# EAGLE design BusPirate-demo (EAGLE 5.10)
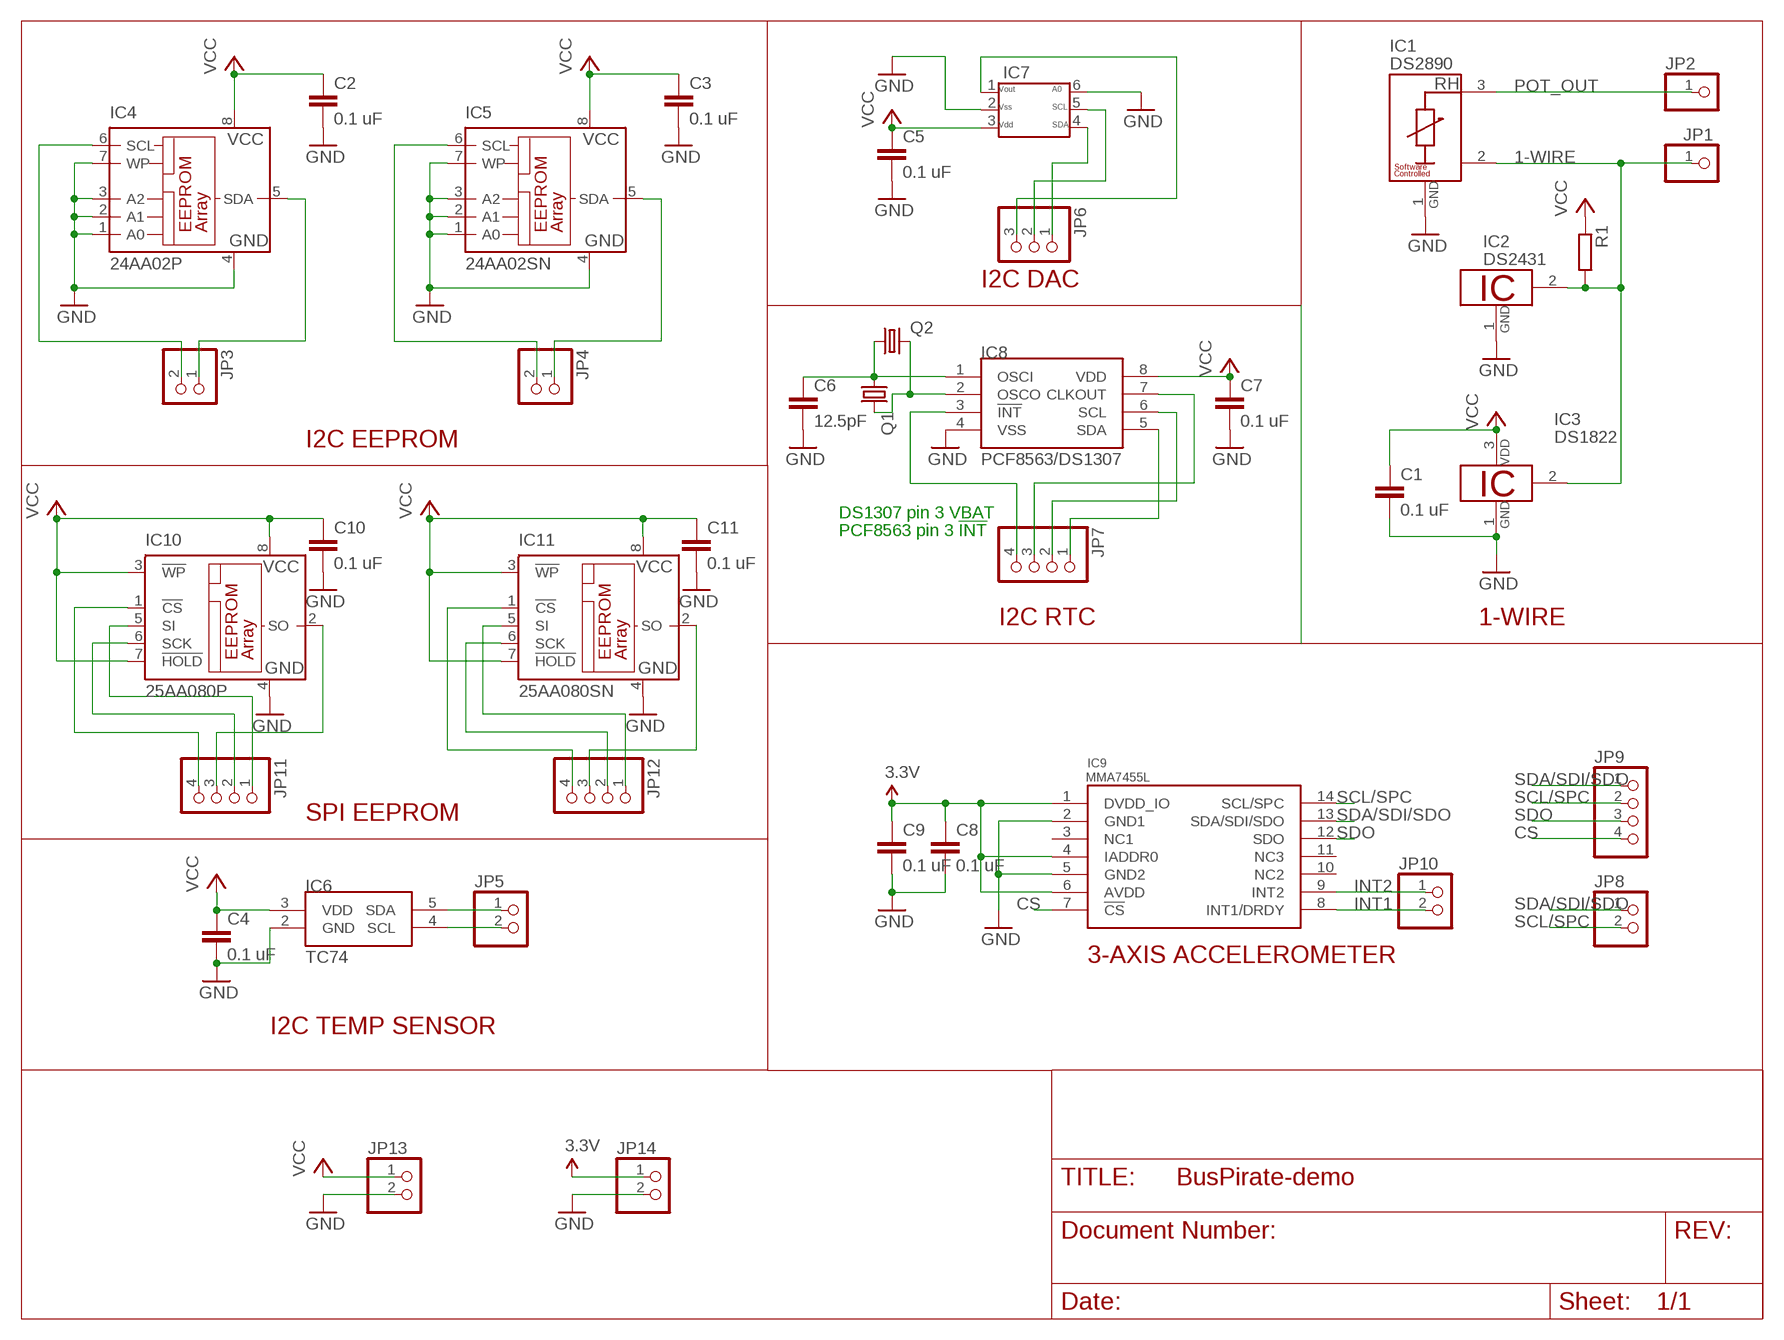
[diagram p0: schematic, sheet 1]

## Parts
C1  0.1 uF  CAPC805  [C805]
C2  0.1 uF  CAPC805  [C805]
C3  0.1 uF  CAPC805  [C805]
C4  0.1 uF  CAPC805  [C805]
C5  0.1 uF  CAPC805  [C805]
C6  12.5pF  CAPC805  [C805]
C7  0.1 uF  CAPC805  [C805]
C8  0.1 uF  CAPC805  [C805]
C9  0.1 uF  CAPC805  [C805]
C10  0.1 uF  CAPC805  [C805]
C11  0.1 uF  CAPC805  [C805]
IC1  DS2890  [TO92-]
IC2  DS2431  [TO92-]
IC3  DS1822  [TO92-]
IC4  24AA02P  [DIL8]
IC5  24AA02SN  [SO-08]
IC6  TC74  [SOT-23-5]
IC7  MCP4725  [SOT23-6]
IC8  PCF8563/DS1307  PCF8563  [SO8]
IC9  MMA7455L  [LGA-14]
IC10  25AA080P  [DIL8]
IC11  25AA080SN  [SO-08]
JP1  PINHD-1X1  [1X01]
JP2  PINHD-1X1  [1X01]
JP3  PINHD-1X2  [1X02]
JP4  PINHD-1X2  [1X02]
JP5  PINHD-1X2  [1X02]
JP6  PINHD-1X3  [1X03]
JP7  PINHD-1X4  [1X04]
JP8  PINHD-1X2  [1X02]
JP9  PINHD-1X4  [1X04]
JP10  PINHD-1X2  [1X02]
JP11  PINHD-1X4  [1X04]
JP12  PINHD-1X4  [1X04]
JP13  PINHD-1X2  [1X02]
JP14  PINHD-1X2  [1X02]
Q1  CRYSTALMM20SS  [MM20SS]
Q2  CRYSTALTC26H  [TC26H]
R1  RESISTORR805R805  [R805]

## Nets
1: IC4.6(SCL) JP3.2
1-WIRE: IC1.2 IC2.2(1W) IC3.2 JP1.1 R1.2
2: IC4.5(SDA) JP3.1
3: IC5.6(SCL) JP4.2
3.3V: C8.1 C9.1 IC9.1(DVDD_IO) IC9.4(IADDR0) IC9.6(AVDD) JP14.1
4: IC5.5(SDA) JP4.1
5: IC6.5(SDA) JP5.1
6: IC6.4(SCL) JP5.2
8: IC7.5 JP6.2
10: IC7.1 JP6.3
11: IC8.3(!INT) JP7.4
12: IC8.7(CLKOUT) JP7.3
13: IC8.6(SCL) JP7.2
14: IC8.5(SDA) JP7.1
CS: IC9.7(!CS) JP9.4
GND: C1.2 C2.2 C3.2 C4.2 C5.2 C6.2 C7.2 C8.2 C9.2 C10.2 C11.2 IC1.1 IC2.1(GND) IC3.1 IC4.1(A0) IC4.2(A1) IC4.3(A2) IC4.4(GND) IC4.7(WP) IC5.1(A0) IC5.2(A1) IC5.3(A2) IC5.4(GND) IC5.7(WP) IC6.2(GND) IC7.2 IC7.6 IC8.4(VSS) IC9.2(GND1) IC9.5(GND2) IC10.4(GND) IC11.4(GND) JP13.2 JP14.2
INT1: IC9.8(INT1/DRDY) JP10.2
INT2: IC9.9(INT2) JP10.1
N$1: IC7.4 JP6.1
N$6: C6.1 IC8.1(OSCI) Q1.1 Q2.1
N$14: IC8.2(OSCO) Q1.4 Q2.2
N$20: IC10.1(!CS) JP11.4
N$21: IC10.2(SO) JP11.3
N$22: IC11.2(SO) JP12.3
N$24: IC10.5(SI) JP11.1
N$30: IC10.6(SCK) JP11.2
N$31: IC11.5(SI) JP12.1
N$32: IC11.6(SCK) JP12.2
N$52: IC11.1(!CS) JP12.4
POT_OUT: IC1.3 JP2.1
SCL/SPC: IC9.14(SCL/SPC) JP8.2 JP9.2
SDA/SDI/SDO: IC9.13(SDA/SDI/SDO) JP8.1 JP9.1
SDO: IC9.12(SDO) JP9.3
VCC: C1.1 C2.1 C3.1 C4.1 C5.1 C7.1 C10.1 C11.1 IC3.3 IC4.8(VCC) IC5.8(VCC) IC6.3(VDD) IC7.3 IC8.8(VDD) IC10.3(!WP) IC10.7(!HOLD) IC10.8(VCC) IC11.3(!WP) IC11.7(!HOLD) IC11.8(VCC) JP13.1 R1.1
Unconnected: IC9.3(NC1) IC9.10(NC2) IC9.11(NC3)

## Notes on the sheet
- I2C DAC
- I2C EEPROM
- DS1307 pin 3 VBAT
- PCF8563 pin 3 !INT
- I2C RTC | 1-WIRE
- SPI EEPROM
- 3-AXIS ACCELEROMETER
- I2C TEMP SENSOR

## Library data of the parts
C1-C11 = dp_devices:CAP
IC1 = 1wire:DS2890: 1-Wire Digital Potentiometer This chip provides a 0..100k RH to GND resistor which can be controlled by software in 256 steps. The RH pin may be connected to levels from 0..11V. Notes: The DS2890P is the same chip in a TSOC6 package with 3 additional pins Vdd, WI and RL, which allows to use the chip as a full featured potentiometer. Author: Jan Kandziora <jjj@gmx.de>
IC2 = 1wire:DS2431: 1024-Bit EEPROM This chip provides a 4x256 Bit EEPROM, which can be programmed@5V. Write protection and OTP emulation are available, too. Author: Jan Kandziora <jjj@gmx.de>
IC3 = 1wire:DS1822: Econo Digital Thermometer This chip provides a onewire thermosensor with approx. 2°C accuracy. A programmable over/undertemperure alarm is available. Notes: Vdd must be applied for accurate measurements at low temperatures, as the parasite power circuit otherwise heats the sensor. If parasite power is used, Vdd has to be connected to GND. The DS18B20 and DS18S20 are similar chips with approx. 0.5°C accuracy. Author: Jan Kandziora <jjj@gmx.de>
IC4 IC5 = microchip:24*: Serial EEPROM I2C
IC6 = dp_devices:TC74
IC7 = dp_devices:MCP4725
IC8 = dp_devices:PCF8563
IC9 = dp_devices:MMA7455L
IC10 IC11 = microchip:25*: Serial EEPROM 4K/ 8K , SPI bus
JP1 JP2 = pinhead - Copy:PINHD-1X1: PIN HEADER
JP3-JP5 JP8 JP10 JP13 JP14 = pinhead - Copy:PINHD-1X2: PIN HEADER
JP6 = pinhead - Copy:PINHD-1X3: PIN HEADER
JP7 JP9 JP11 JP12 = pinhead - Copy:PINHD-1X4: PIN HEADER
Q1 Q2 = crystal:CRYSTAL: CRYSTAL
R1 = dp_devices:RESISTOR

## Board
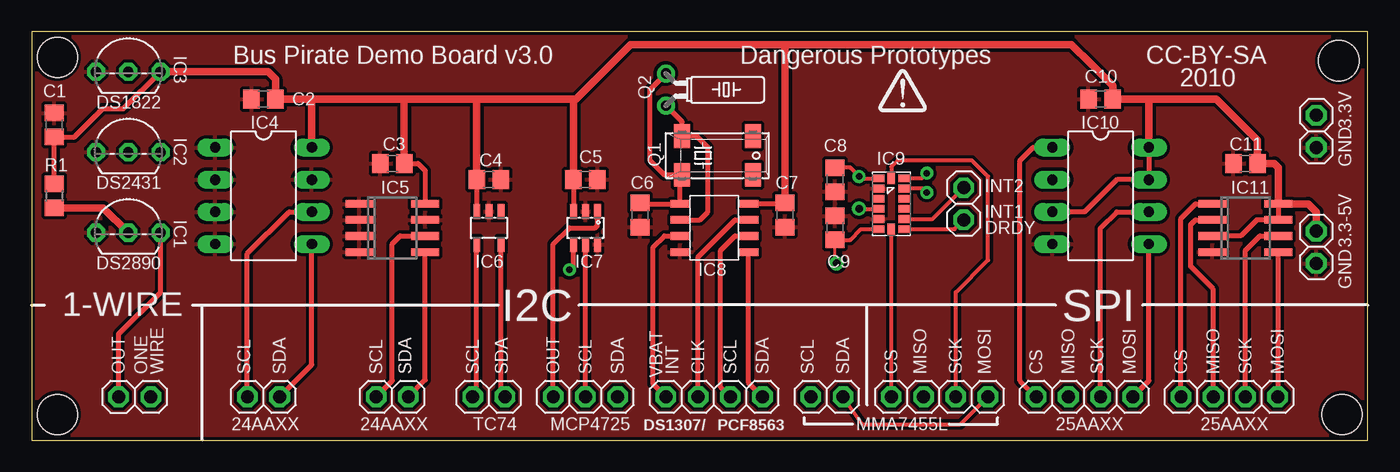
[diagram p1: board, top side]
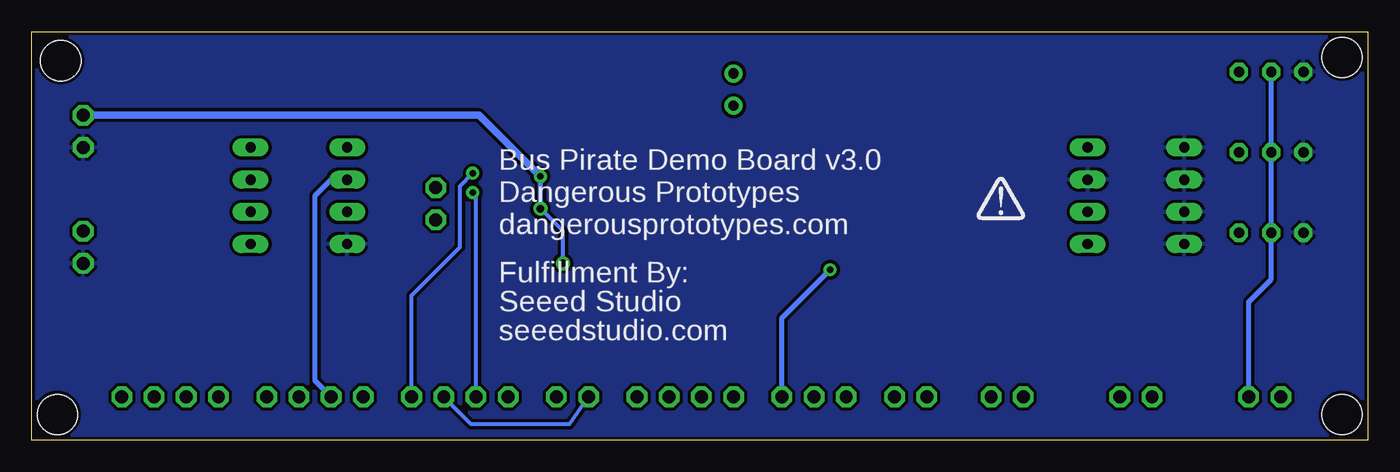
[diagram p2: board, bottom side, seen from below]

Size 105.41 x 32.26 mm. Coordinates in mm from the lower left corner, seen from the top.
Outline: 0,0 105.41,0 105.41,32.26 0,32.26 0,0
Copper layers (1*16): Top 0.035mm / dielectric 1.5mm / Bottom 0.035mm
Design rules "SparkFun - modified *": minimum track width 8mil, minimum drill 15mil, track to track 6mil, track to pad 6mil, pad to pad 6mil, via to via 6mil, smd to smd 6mil, copper to edge 10mil, drill to drill 8mil, minimum pad ring 12mil, minimum via ring 10mil, stop-mask expansion 4mil, vias tented up to drill 25mil, thermal gap 10mil
Holes 3.2 mm at 2.03,2.03 103.38,2.03 103.12,29.97 2.03,30.23

### Footprints (pad centres in the part's own frame; a part is rotated, then mirrored left to right if it is on the bottom)
C805 = smd 1.3 x 1.5: 1 -0.95,0; 2 0.95,0
TO92- = drill 0.813 octagon: 1 -2.54,0; 2 0,0; 3 2.54,0
DIL8 = drill 0.813 long: 1 -3.81,-3.81; 2 -1.27,-3.81; 3 1.27,-3.81; 4 3.81,-3.81; 5 3.81,3.81; 6 1.27,3.81; 7 -1.27,3.81; 8 -3.81,3.81
SO-08 = smd 0.6 x 2.2: 1 -1.905,-2.6; 2 -0.635,-2.6; 3 0.635,-2.6; 4 1.905,-2.6; 5 1.905,2.6; 6 0.635,2.6; 7 -0.635,2.6; 8 -1.905,2.6
SOT-23-5 = smd 0.55 x 1.2: 1 -0.95,-1.3; 2 0,-1.3; 3 0.95,-1.3; 4 0.95,1.3; 5 -0.95,1.3
SOT23-6 = smd 0.55 x 1.2: 1 -0.95,-1.3; 2 0,-1.3; 3 0.95,-1.3; 4 0.95,1.3; 5 0,1.3; 6 -0.95,1.3
SO8 = smd 0.6 x 1.55: 1 -1.905,-2.69; 2 -0.635,-2.69; 3 0.635,-2.69; 4 1.905,-2.69; 5 1.905,2.71; 6 0.635,2.71; 7 -0.635,2.71; 8 -1.905,2.71
LGA-14 = smd 0.6 x 0.9: 1 -2,-1; 2 -1.2,-1; 3 -0.4,-1; 4 0.4,-1; 5 1.2,-1; 6 2,-1; 8 2,1; 9 1.2,1; 10 0.4,1; 11 -0.4,1; 12 -1.2,1; 13 -2,1 | smd 0.9 x 0.6: 7 2,0; 14 -2,0
1X01 = drill 1.016 octagon: 1 0,0
1X02 = drill 1.016 octagon: 1 -1.27,0; 2 1.27,0
1X03 = drill 1.016 octagon: 1 -2.54,0; 2 0,0; 3 2.54,0
1X04 = drill 1.016 octagon: 1 -3.81,0; 2 -1.27,0; 3 1.27,0; 4 3.81,0
MM20SS = smd 1.27 x 1.88: 1 -2.794,-1.524; 2 2.794,-1.524; 3 2.794,1.524; 4 -2.794,1.524
TC26H = drill 0.813 round: 1 -1.27,0; 2 1.27,0
R805 = smd 1.3 x 1.5: 1 -0.95,0; 2 0.95,0

### Placement (x,y rotation side)
C1  1.78,24.89 90 top
C2  18.29,26.92 180 top
C3  28.45,21.84 180 top
C4  36.07,20.57 0 top
C5  43.69,20.57 0 top
C6  48.01,17.78 270 top
C7  59.44,17.78 270 top
C8  63.37,20.57 270 top
C9  63.37,16.76 90 top
C10  84.33,26.92 180 top
C11  95.76,21.84 180 top
IC1  7.62,16.38 0 top
IC2  7.62,22.73 0 top
IC3  7.62,29.08 0 top
IC4  18.29,19.3 270 top
IC5  28.45,16.76 270 top
IC6  36.07,16.76 180 top
IC7  43.69,16.76 180 top
IC8  53.85,16.76 270 top
IC9  67.82,18.67 270 top
IC10  84.33,19.3 270 top
IC11  95.76,16.76 270 top
JP1  9.4,3.43 0 top
JP2  6.86,3.43 90 top
JP3  18.29,3.43 180 top
JP4  28.45,3.43 180 top
JP5  36.07,3.43 180 top
JP6  43.69,3.43 180 top
JP7  53.85,3.43 180 top
JP8  62.74,3.43 180 top
JP9  71.63,3.43 180 top
JP10  73.53,18.67 270 top
JP11  83.06,3.43 180 top
JP12  94.49,3.43 180 top
JP13  101.35,15.24 270 top
JP14  101.35,24.38 270 top
Q1  32.768KHz  [MM20SS]  54.1,22.48 0 top
Q2  32.768KHz  [TC26H]  50.04,27.69 270 top
R1  1.78,19.3 270 top
U$1  [DP_LOGO]  68.71,26.54 0 top
U$2  [DP_LOGO]  28.96,18.03 0 bottom

### Tracks (layer width: path | path; a pad name or v marks a point on that pad's centre or on a via)
1
  Top 0.406: JP3.2 17.02,14.73 20.32,18.03 IC4.6
1-WIRE
  Top 0.61: R1.2 5.65,18.35 IC1.2
  Bottom 0.406: IC3.2 IC2.2 IC1.2 7.62,12.7 9.4,10.92 JP1.1
2
  Top 0.406: IC4.5 22.1,5.97 JP3.1
3
  Top 0.406: IC5.6 29.08,16.13 28.45,15.49 28.45,4.7 JP4.2
3.3V  (via drill 0.51, 0.6)
  Top 0.254: C9.1 63.37,14.1 v63.5,13.97
  Top 0.305: IC9.6 65.44,16.67 64.58,15.81 C9.1 | IC9.4 65.3,18.27 v65.28,18.29 | C8.1 64.58,21.52 v65.28,20.83 65.44,20.67 IC9.1
  Bottom 0.305: v63.5,13.97 63.5,16.51 v65.28,18.29
  Bottom 0.406: v65.28,18.29 v65.28,20.83 65.28,21.08
  Bottom 0.61: JP14.1 70.1,25.65 v65.28,20.83
4
  Top 0.406: IC5.5 31.05,4.76 JP4.1
5
  Top 0.406: IC6.5 37.02,3.75 JP5.1
6
  Top 0.406: IC6.4 35.12,3.75 JP5.2
8
  Top 0.406: JP6.2 IC7.5
10
  Top 0.406: IC7.1 44.64,16.95 44.45,16.76 42.42,16.76 41.15,15.49 JP6.3
11
  Top 0.406: IC8.3 49.91,16.13 49.02,15.24 49.02,4.45 JP7.4
12
  Top 0.406: IC8.7 55.5,17.4 52.58,14.48 JP7.3
13
  Top 0.406: IC8.6 55.5,16.13 54.36,14.99 54.36,4.19 JP7.2
14
  Top 0.406: IC8.5 56.56,4.53 JP7.1
CS
  Top 0.305: JP9.4 IC9.7
GND
  pour Bottom (isolate 0.254): 0,32.26 0,0 105.41,0 105.41,32.26
  pour Top (isolate 0.254): 0,0 105.41,0 105.41,32.26 0,32.26
INT1
  Top 0.305: IC9.8 72.8,16.67 JP10.2
INT2
  Top 0.305: IC9.9 71.06,17.47 JP10.1
N$1  (via drill 0.51)
  Top 0.406: IC7.4 42.74,13.78 v42.42,13.46
  Bottom 0.406: v42.42,13.46 46.23,9.65 JP6.1
N$6
  Top 0.406: Q2.1 48.77,27.69 48.77,22.1 49.91,20.95 Q1.1 51.16,20.85 IC8.1 48.07,18.67 C6.1
N$14
  Top 0.406: IC8.2 52.7,17.4 53.34,18.03 53.34,23.11 52.45,24 Q1.4 51.31,25.15 Q2.2
N$20
  Top 0.406: IC10.1 78.99,23.11 77.98,22.1 77.98,4.7 JP11.4
N$21
  Bottom 0.406: IC10.2 81.79,20.57 83.06,19.3 83.06,4.7 JP11.3
N$22
  Top 0.406: IC11.2 91.82,17.4 91.44,17.02 91.44,13.72 93.22,11.94 JP12.3
N$24
  Top 0.406: IC10.5 88.14,4.7 JP11.1
N$30
  Top 0.406: IC10.6 85.6,18.03 84.33,16.76 JP11.2
N$31
  Top 0.406: IC11.5 98.36,3.49 JP12.1
N$32
  Top 0.406: JP12.2 95.76,14.99 96.9,16.13 IC11.6
N$52
  Top 0.406: IC11.1 91.82,18.67 90.68,17.53 JP12.4
POT_OUT
  Top 0.406: IC1.3 10.16,11.68 6.86,8.38 JP2.1
SCL/SPC
  Top 0.305: IC9.14 67.82,21.59 68.33,22.1 74.17,22.1 75.44,20.83 75.44,14.22 72.9,11.68 JP9.2
  Bottom 0.305: JP8.2 62.99,1.27 70.74,1.27 JP9.2
SDA/SDI/SDO  (via drill 0.51)
  Top 0.305: IC9.13 70.2,20.67 v70.61,21.08 | JP8.1 65.53,1.27 73.28,1.27 JP9.1
  Bottom 0.305: v70.61,21.08 71.63,20.07 71.63,15.24 75.44,11.43 JP9.1
SDO  (via drill 0.51)
  Top 0.305: IC9.12 70.3,19.87 v70.61,19.56
  Bottom 0.305: JP9.3 70.36,19.3 v70.61,19.56
VCC
  Top 0.406: IC11.3 95.38,16.13 96.65,17.4 IC11.7 IC11.8 | IC10.3 83.06,18.03 85.6,20.57 IC10.7 IC10.8 | IC5.8 31.05,21.28 30.48,21.84 C3.1 | C4.1 IC6.3 | C5.1 IC7.3 | R1.1 C1.1 3.37,23.94 5.59,26.16 7.24,26.16 IC3.3 | IC8.8 59.38,18.67 C7.1
  Top 0.61: 88.14,26.92 IC10.8 | 22.1,26.92 C2.1 19.24,28.51 18.67,29.08 IC3.3 | 22.1,26.92 IC4.8 | 22.1,26.92 29.46,26.92 | 29.46,26.92 35.05,26.92 | C3.1 29.4,26.86 29.46,26.92 | C4.1 35.12,26.86 35.05,26.92 | 88.14,26.92 C10.1 85.28,28.01 83.57,29.72 82.04,31.24 59.44,31.24 | 88.14,26.92 93.47,26.92 96.71,23.69 C11.1 98.04,21.84 98.36,21.53 IC11.8 100.71,18.67 101.35,18.03 JP13.1 | 35.05,26.92 42.93,26.92 | 42.93,26.92 47.24,31.24 59.44,31.24 | C5.1 42.74,26.74 42.93,26.92 | 59.44,31.24 C7.1

### Text on the board
tPlace: Bus Pirate Demo Board v3.0 | Dangerous Prototypes | CC-BY-SA | 2010 | DS1822 | 3.3V | GND | DS2431 | INT2 | INT1 | DRDY | 3.3-5V | DS2890 | GND | 1-WIRE | I2C | SPI | OUT | ONE | WIRE | SCL | SDA | SCL | SDA | SCL | SDA | OUT | SCL | SDA | VBAT | INT | CLK | SCL | SDA | SCL | SDA | CS | MISO | SCK | MOSI | CS | MISO | SCK | MOSI | CS | MISO | SCK | MOSI | 24AAXX | 24AAXX | TC74 | MCP4725 | DS1307/ | PCF8563 | MMA7455L | 25AAXX | 25AAXX
bPlace: Bus Pirate Demo Board v3.0 | Dangerous Prototypes | dangerousprototypes.com | Fulfillment By: | Seeed Studio | seeedstudio.com